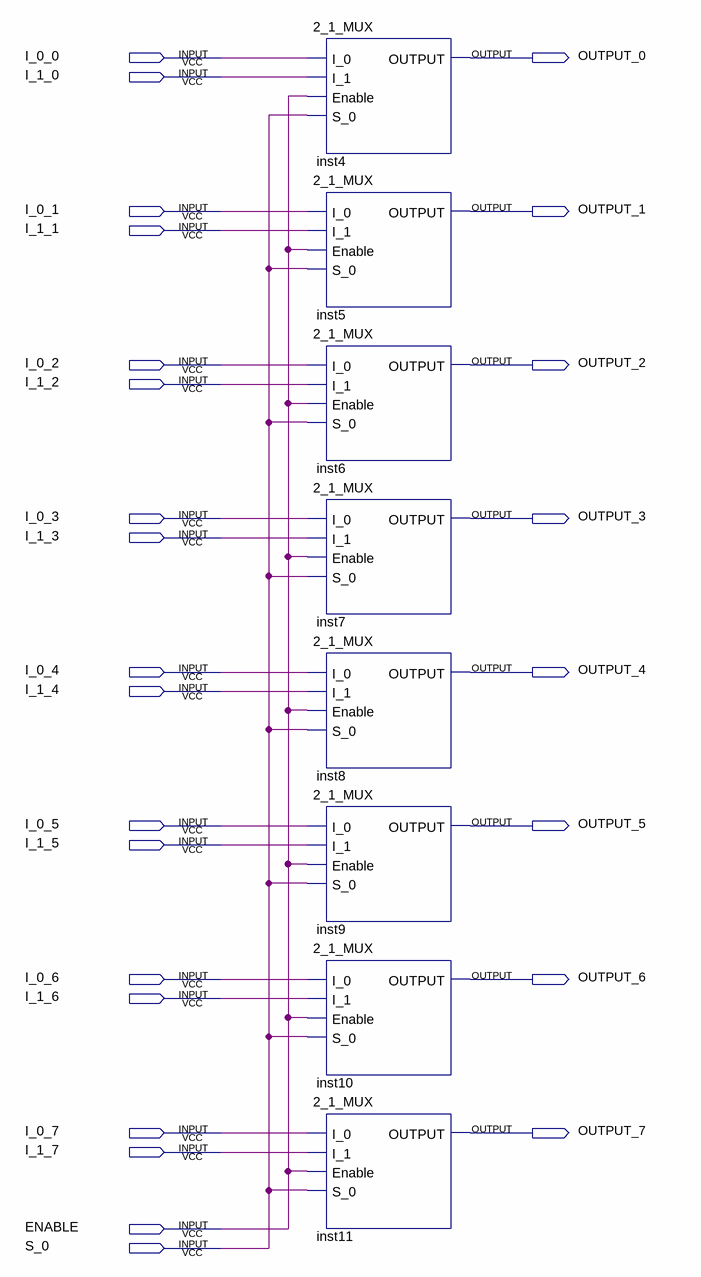
[diagram p0: schematic sheet]
// Quartus schematic 8_2_1_MUX.bdf as structural Verilog: 8 symbols, 26 pins
module \8_2_1_MUX  (
  input  I_0_0,
  input  I_1_0,
  input  I_0_1,
  input  I_1_1,
  input  I_0_2,
  input  I_1_2,
  input  I_0_3,
  input  I_1_3,
  input  I_0_4,
  input  I_1_4,
  input  I_0_5,
  input  I_1_5,
  input  I_0_6,
  input  I_1_6,
  input  I_0_7,
  input  I_1_7,
  input  ENABLE,
  input  S_0,
  output OUTPUT_0,
  output OUTPUT_1,
  output OUTPUT_2,
  output OUTPUT_3,
  output OUTPUT_4,
  output OUTPUT_5,
  output OUTPUT_6,
  output OUTPUT_7
);

  \2_1_MUX  inst4 (.I_0(I_0_0), .I_1(I_1_0), .Enable(ENABLE), .S_0(S_0), .OUTPUT(OUTPUT_0));
  \2_1_MUX  inst5 (.I_0(I_0_1), .I_1(I_1_1), .Enable(ENABLE), .S_0(S_0), .OUTPUT(OUTPUT_1));
  \2_1_MUX  inst6 (.I_0(I_0_2), .I_1(I_1_2), .Enable(ENABLE), .S_0(S_0), .OUTPUT(OUTPUT_2));
  \2_1_MUX  inst7 (.I_0(I_0_3), .I_1(I_1_3), .Enable(ENABLE), .S_0(S_0), .OUTPUT(OUTPUT_3));
  \2_1_MUX  inst8 (.I_0(I_0_4), .I_1(I_1_4), .Enable(ENABLE), .S_0(S_0), .OUTPUT(OUTPUT_4));
  \2_1_MUX  inst9 (.I_0(I_0_5), .I_1(I_1_5), .Enable(ENABLE), .S_0(S_0), .OUTPUT(OUTPUT_5));
  \2_1_MUX  inst10 (.I_0(I_0_6), .I_1(I_1_6), .Enable(ENABLE), .S_0(S_0), .OUTPUT(OUTPUT_6));
  \2_1_MUX  inst11 (.I_0(I_0_7), .I_1(I_1_7), .Enable(ENABLE), .S_0(S_0), .OUTPUT(OUTPUT_7));
endmodule
